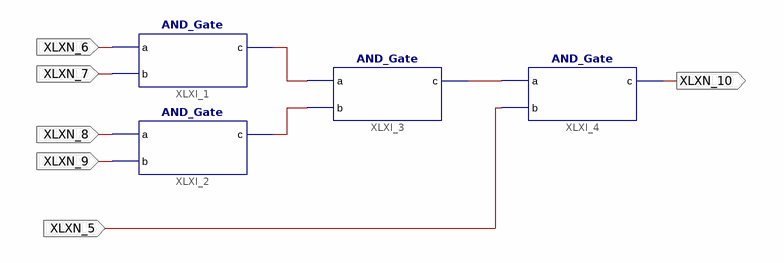
[diagram p0: schematic sheet 1]
// Xilinx ISE schematic AND_5.sch (spartan6) as structural Verilog: 4 symbols, 6 ports
module AND_5 (
  input  XLXN_5,
  input  XLXN_6,
  input  XLXN_7,
  input  XLXN_8,
  input  XLXN_9,
  output XLXN_10
);

  wire XLXN_1, XLXN_2, XLXN_3;

  AND_Gate XLXI_1 (.a(XLXN_6), .b(XLXN_7), .c(XLXN_1));
  AND_Gate XLXI_2 (.a(XLXN_8), .b(XLXN_9), .c(XLXN_2));
  AND_Gate XLXI_3 (.a(XLXN_1), .b(XLXN_2), .c(XLXN_3));
  AND_Gate XLXI_4 (.a(XLXN_3), .b(XLXN_5), .c(XLXN_10));
endmodule
